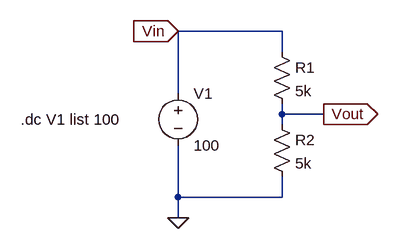
[diagram p0: schematic Unbelasteter Spannungsteiler.asc]
Unbelasteter Spannungsteiler.asc, the LTspice schematic file:
Version 4
SHEET 1 880 680
WIRE 192 32 32 32
WIRE 192 64 192 32
WIRE 32 128 32 32
WIRE 192 160 192 144
WIRE 256 160 192 160
WIRE 192 176 192 160
WIRE 32 288 32 208
WIRE 192 288 192 256
WIRE 192 288 32 288
WIRE 32 320 32 288
FLAG 32 320 0
FLAG 256 160 Vout
IOPIN 256 160 Out
FLAG 32 32 Vin
IOPIN 32 32 In
SYMBOL voltage 32 112 R0
WINDOW 123 0 0 Left 0
WINDOW 39 0 0 Left 0
SYMATTR InstName V1
SYMATTR Value 100
SYMBOL res 176 48 R0
SYMATTR InstName R1
SYMATTR Value 5k
SYMBOL res 176 160 R0
SYMATTR InstName R2
SYMATTR Value 5k
TEXT -210 168 Left 2 !.dc V1 list 100

The netlist it stands for:
* Unbelasteter Spannungsteiler.asc
V1 Vin 0 100
R1 Vin Vout 5k
R2 Vout 0 5k
.dc V1 list 100
.backanno
.end